# Altium schematic sheet ChassisPowerDistribution_B_1.0_RW.SchDoc
size A2 portrait
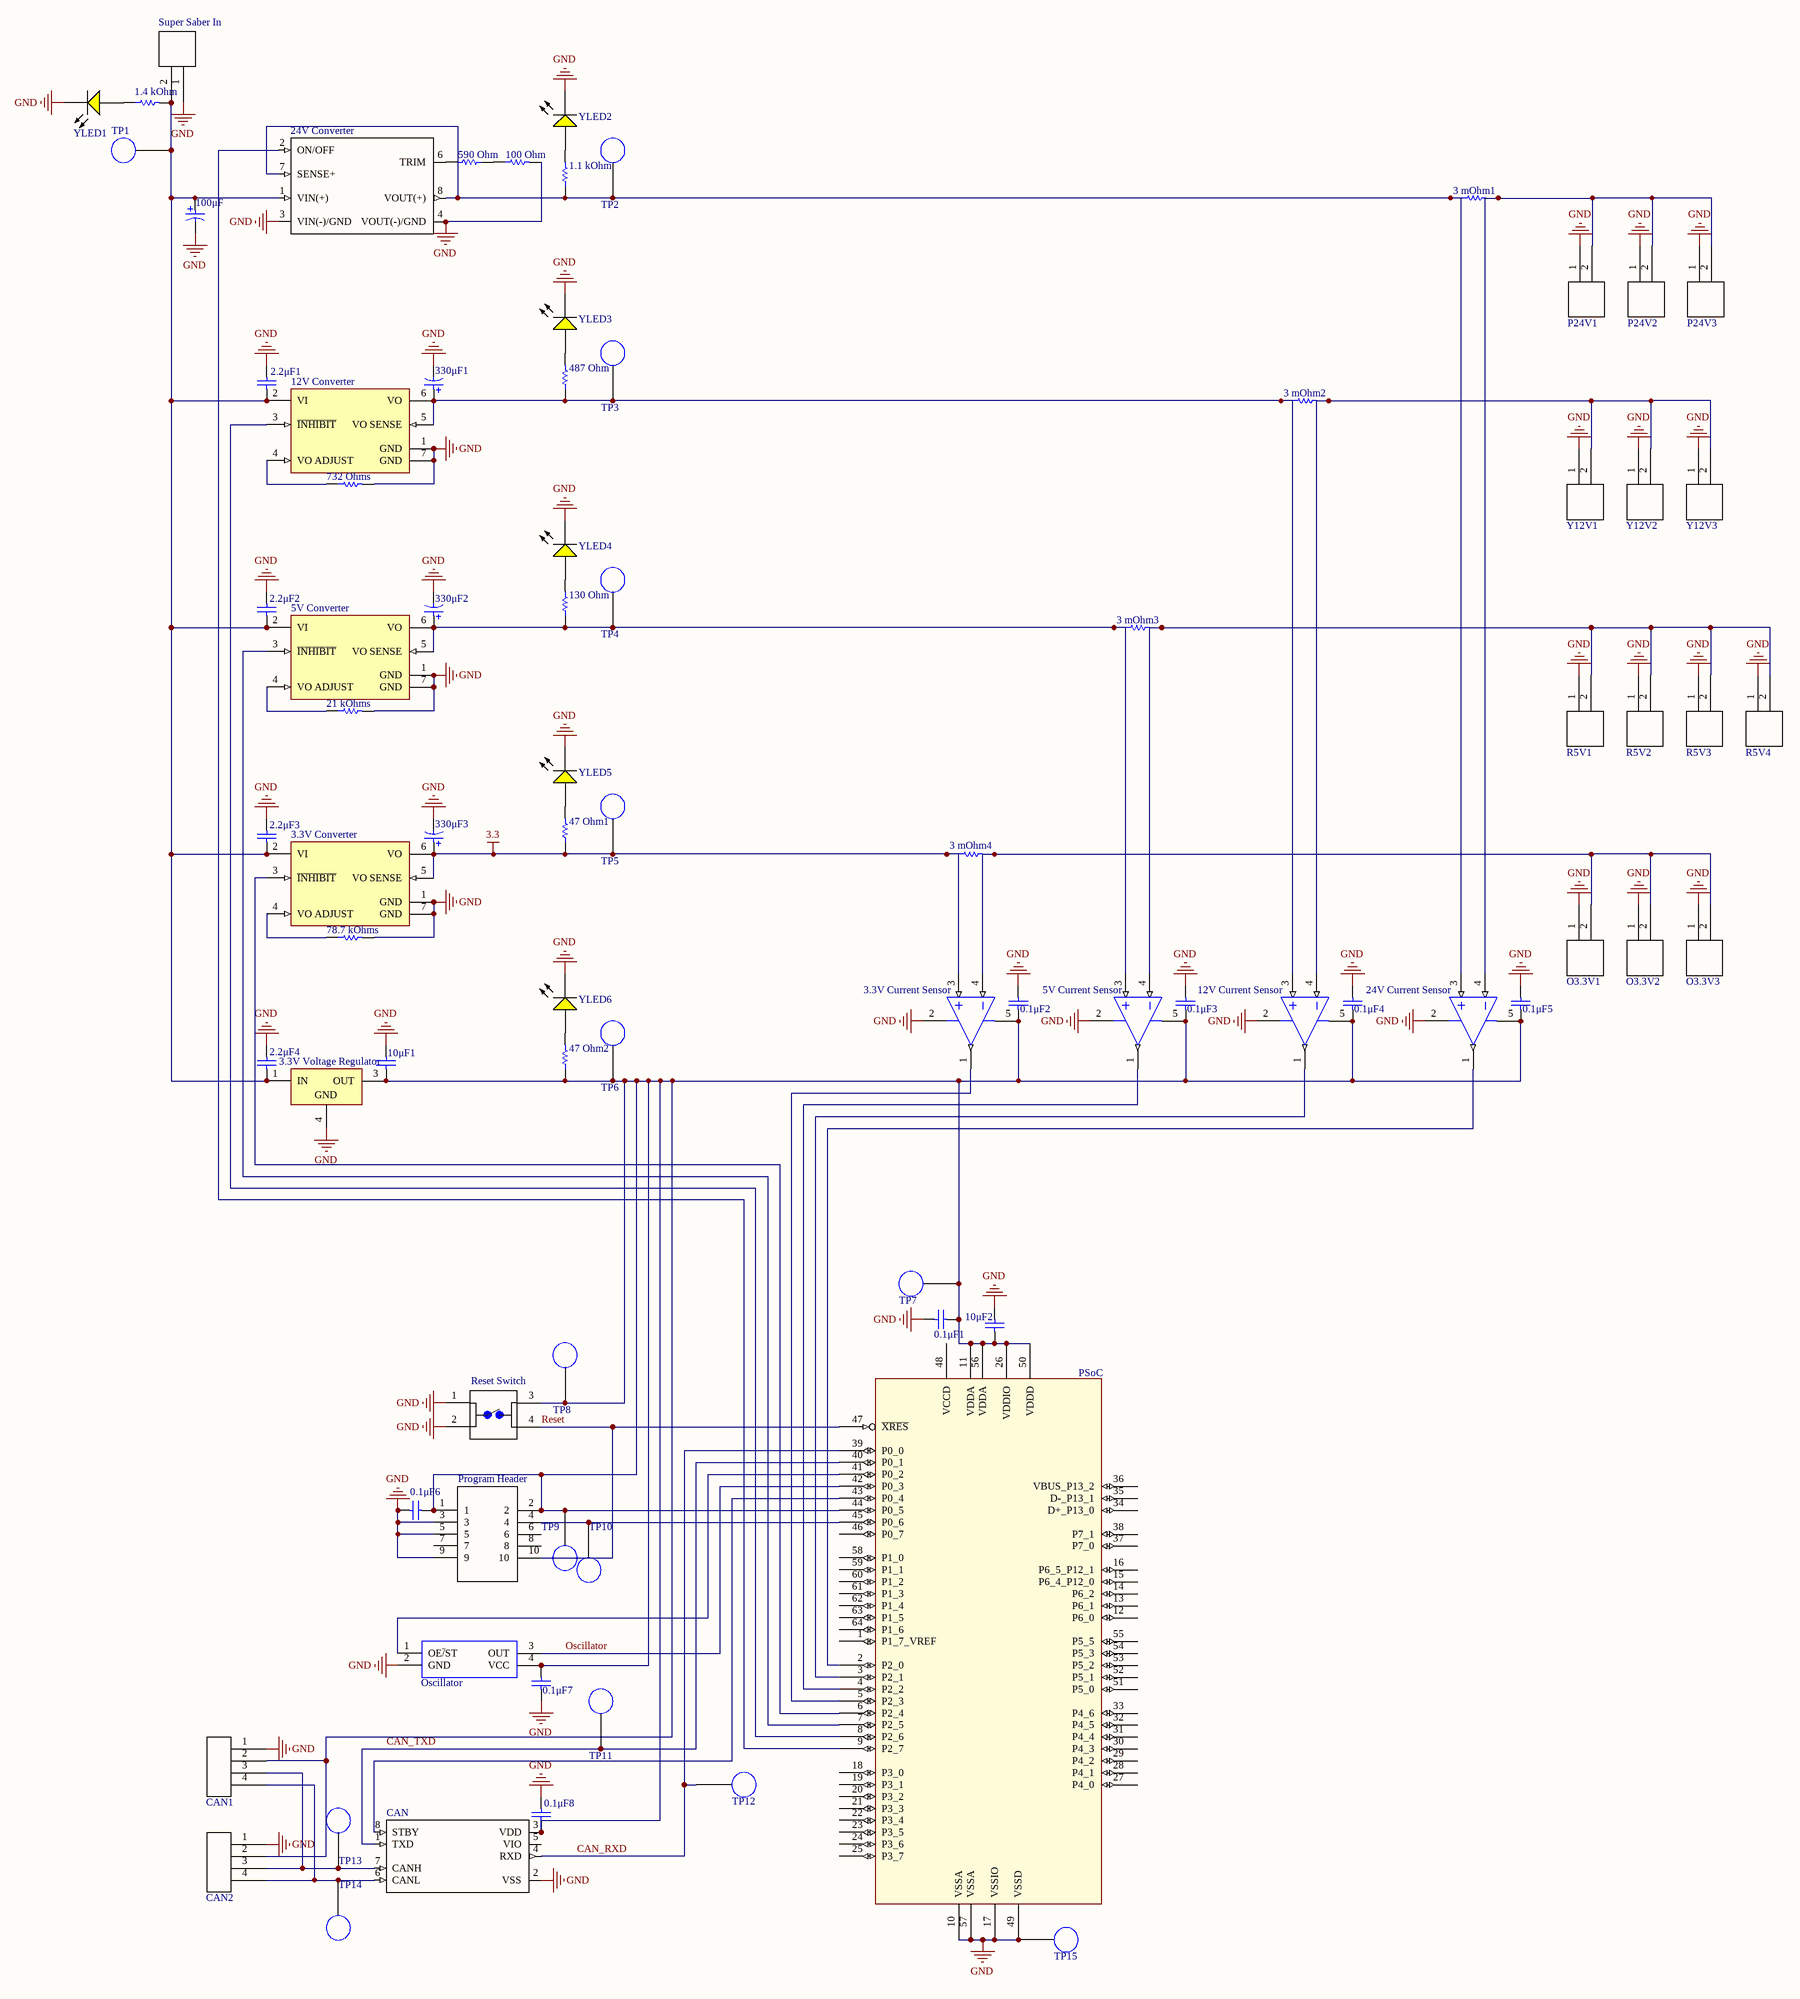
[diagram p0: ChassisPowerDistribution_B_1.0_RW.SchDoc]

## Parts
0.1μF1  C0805C104Z5VACTU  [CAPC2013X145X50LL20T25]  (value not drawn)
0.1μF2  C0805C104Z5VACTU  [CAPC2013X145X50LL20T25]  (value not drawn)
0.1μF3  C0805C104Z5VACTU  [CAPC2013X145X50LL20T25]  (value not drawn)
0.1μF4  C0805C104Z5VACTU  [CAPC2013X145X50LL20T25]  (value not drawn)
0.1μF5  C0805C104Z5VACTU  [CAPC2013X145X50LL20T25]  (value not drawn)
0.1μF6  C0805C104Z5VACTU  [CAPC2013X145X50LL20T25]  (value not drawn)
0.1μF7  C0805C104Z5VACTU  [CAPC2013X145X50LL20T25]  (value not drawn)
0.1μF8  C0805C104Z5VACTU  [CAPC2013X145X50LL20T25]  (value not drawn)
1.1_kOhm  ERJ-6GEYJ112V  [RESC2013X70X40ML20T20]  (value not drawn)
1.4_kOhm  RC0805FR-071K4L  [RESC2013X60X35ML10T20]  (value not drawn)
2.2μF1  C2012X7R1H225K125AC  [CAPC2013X145X20LL20]  (value not drawn)
2.2μF2  C2012X7R1H225K125AC  [CAPC2013X145X20LL20]  (value not drawn)
2.2μF3  C2012X7R1H225K125AC  [CAPC2013X145X20LL20]  (value not drawn)
2.2μF4  C2012X7R1H225K125AC  [CAPC2013X145X20LL20]  (value not drawn)
3.3V_Converter  PTN78020WAH  [EUK0007A]  (value not drawn)
3.3V_Current_Sensor  INA194AIDBVR  [DBV0005A_M]  (value not drawn)
3.3V_Voltage_Regulator  LP2950CDTX-3.3  [TD03B_M]  (value not drawn)
3_mOhm1  OAR5R003JLF  [OAR5R003JLF]  (value not drawn)
3_mOhm2  OAR5R003JLF  [OAR5R003JLF]  (value not drawn)
3_mOhm3  OAR5R003JLF  [OAR5R003JLF]  (value not drawn)
3_mOhm4  OAR5R003JLF  [OAR5R003JLF]  (value not drawn)
5V_Converter  PTN78020WAH  [EUK0007A]  (value not drawn)
5V_Current_Sensor  INA194AIDBVR  [DBV0005A_M]  (value not drawn)
10μF1  TPSR106K006R1000  [CAPC2113X140X50ML20T30]  (value not drawn)
10μF2  TPSR106K006R1000  [CAPC2113X140X50ML20T30]  (value not drawn)
12V_Converter  PTN78020WAH  [EUK0007A]  (value not drawn)
12V_Current_Sensor  INA194AIDBVR  [DBV0005A_M]  (value not drawn)
21_kOhms  ERJ-6ENF2102V  [RESC2013X70X40ML20T20]  (value not drawn)
24V_Converter  I6A4W010A033V-001-R  [*TDK-LAMBDA_I6A4W020A033V-001-R]  (value not drawn)
24V_Current_Sensor  INA194AIDBVR  [DBV0005A_M]  (value not drawn)
47_Ohm1  RR1220Q-470-D  [RESC2013X50X40LL20T20]  (value not drawn)
47_Ohm2  RR1220Q-470-D  [RESC2013X50X40LL20T20]  (value not drawn)
78.7_kOhms  ERJ-6ENF7872V  [RESC2013X70X40LL20T20]  (value not drawn)
100_Ohm  ERJ-6ENF1000V  [RESC2013X70X40LL20T20]  (value not drawn)
100μF  EEU-FC1V101  [*CAPPRD350W60D800H2000]  (value not drawn)
130_Ohm  RC0805JR-07130RL  [RESC2013X60X35ML10T20]  (value not drawn)
330μF1  EEU-FC1V331B  [*CAPPRD350W60D800H2000]  (value not drawn)
330μF2  EEU-FC1V331B  [*CAPPRD350W60D800H2000]  (value not drawn)
330μF3  EEU-FC1V331B  [*CAPPRD350W60D800H2000]  (value not drawn)
487_Ohm  RC0805FR-07487RL  [RESC2013X60X35NL10T20]  (value not drawn)
590_Ohm  ERJ-6ENF5900V  [RESC2013X70X40LL20T20]  (value not drawn)
732_Ohms  ERJ-6ENF7320V  [RESC2013X70X40LL20T20]  (value not drawn)
CAN  MCP2562-E/SN  [SOIC127P600X175-8N]  (value not drawn)
CAN1  Molex Micro  [0430450427]  (value not drawn)
CAN2  Molex Micro  [0430450427]  (value not drawn)
O3.3V1  *  [1510482204]  (value not drawn)
O3.3V2  *  [1510482204]  (value not drawn)
O3.3V3  *  [1510482204]  (value not drawn)
Oscillator  SG-636PCW_50.0000MC3__ROHS  [SG-636]  (value not drawn)
P24V1  *  [1510482204]  (value not drawn)
P24V2  *  [1510482204]  (value not drawn)
P24V3  *  [1510482204]  (value not drawn)
Program_Header  *  [SAMTEC-FTSH-105-01-X-D]  (value not drawn)
PSoC  CY8C4248AZI-L485  [TQFP50P1200X1200X160-64N]  (value not drawn)
R5V1  *  [1510482204]  (value not drawn)
R5V2  *  [1510482204]  (value not drawn)
R5V3  *  [1510482204]  (value not drawn)
R5V4  *  [1510482204]  (value not drawn)
Reset_Switch  1825910-7  [Switch 6mm 24V (NO)]  (value not drawn)
Super_Saber_In  *  (value not drawn)
TP1  *  [Test Point Through-hole]  (value not drawn)
TP2  *  [Test Point Through-hole]  (value not drawn)
TP3  *  [Test Point Through-hole]  (value not drawn)
TP4  *  [Test Point Through-hole]  (value not drawn)
TP5  *  [Test Point Through-hole]  (value not drawn)
TP6  *  [Test Point Through-hole]  (value not drawn)
TP7  *  [Test Point Through-hole]  (value not drawn)
TP8  *  [Test Point Through-hole]  (value not drawn)
TP9  *  [Test Point Through-hole]  (value not drawn)
TP10  *  [Test Point Through-hole]  (value not drawn)
TP11  *  [Test Point Through-hole]  (value not drawn)
TP12  *  [Test Point Through-hole]  (value not drawn)
TP13  *  [Test Point Through-hole]  (value not drawn)
TP14  *  [Test Point Through-hole]  (value not drawn)
TP15  *  [Test Point Through-hole]  (value not drawn)
Y12V1  *  [1510482204]  (value not drawn)
Y12V2  *  [1510482204]  (value not drawn)
Y12V3  *  [1510482204]  (value not drawn)
YLED1  LTST-C170KSKT  [LTST-C170KSKT_V]  (value not drawn)
YLED2  LTST-C170KSKT  [LTST-C170KSKT_V]  (value not drawn)
YLED3  LTST-C170KSKT  [LTST-C170KSKT_V]  (value not drawn)
YLED4  LTST-C170KSKT  [LTST-C170KSKT_V]  (value not drawn)
YLED5  LTST-C170KSKT  [LTST-C170KSKT_V]  (value not drawn)
YLED6  LTST-C170KSKT  [LTST-C170KSKT_V]  (value not drawn)

## Nets
3.3: 3.3V_Converter.5(VO_SENSE) 3.3V_Converter.6(VO) 3.3V_Current_Sensor.3(VIN+) 3_mOhm4.1 47_Ohm1.1 330μF3.1 TP5.1
GND: 0.1μF1.1 0.1μF2.2 0.1μF3.2 0.1μF4.2 0.1μF5.2 0.1μF6.1 0.1μF7.2 0.1μF8.2 2.2μF1.2 2.2μF2.2 2.2μF3.2 2.2μF4.2 3.3V_Converter.1(GND) 3.3V_Converter.7(GND) 3.3V_Current_Sensor.2(GND) 3.3V_Voltage_Regulator.4(GND) 5V_Converter.1(GND) 5V_Converter.7(GND) 5V_Current_Sensor.2(GND) 10μF1.2 10μF2.2 12V_Converter.1(GND) 12V_Converter.7(GND) 12V_Current_Sensor.2(GND) 21_kOhms.2 24V_Converter.3(VIN(-)/GND) 24V_Converter.4(VOUT(-)/GND) 24V_Current_Sensor.2(GND) 78.7_kOhms.2 100_Ohm.2 100μF.2 330μF1.2 330μF2.2 330μF3.2 732_Ohms.2 CAN.2(VSS) CAN1.1 CAN2.1 O3.3V1.1 O3.3V2.1 O3.3V3.1 Oscillator.2(GND) P24V1.1 P24V2.1 P24V3.1 Program_Header.3 Program_Header.5 Program_Header.9 PSoC.10(VSSA) PSoC.17(VSSIO) PSoC.49(VSSD) PSoC.57(VSSA) R5V1.1 R5V2.1 R5V3.1 R5V4.1 Reset_Switch.1 Reset_Switch.2 Super_Saber_In.1 TP15.1 Y12V1.1 Y12V2.1 Y12V3.1 YLED1.2(K) YLED2.2(K) YLED3.2(K) YLED4.2(K) YLED5.2(K) YLED6.2(K)
CAN_RXD: CAN.4(RXD) PSoC.39(P0_0) TP12.1
CAN_TXD: CAN.1(TXD) PSoC.40(P0_1) TP11.1
Oscillator: Oscillator.3(OUT) PSoC.42(P0_3)
Reset: Program_Header.10 PSoC.47(~{XRES}) Reset_Switch.4
Net0.1μF1_2: 0.1μF1.2 0.1μF2.1 0.1μF3.1 0.1μF4.1 0.1μF5.1 0.1μF6.2 0.1μF7.1 0.1μF8.1 3.3V_Current_Sensor.5(V+) 3.3V_Voltage_Regulator.3(OUT) 5V_Current_Sensor.5(V+) 10μF1.1 10μF2.1 12V_Current_Sensor.5(V+) 24V_Current_Sensor.5(V+) 47_Ohm2.1 CAN.3(VDD) CAN1.2 CAN2.2 Oscillator.4(VCC) Program_Header.1 Program_Header.2 PSoC.11(VDDA) PSoC.26(VDDIO) PSoC.44(P0_5) PSoC.50(VDDD) PSoC.56(VDDA) Reset_Switch.3 TP6.1 TP7.1 TP8.1 TP9.1
Net1.1_kOhm_1: 1.1_kOhm.1 3_mOhm1.1 24V_Converter.7(SENSE+) 24V_Converter.8(VOUT(+)) 24V_Current_Sensor.3(VIN+) TP2.1
Net1.1_kOhm_2: 1.1_kOhm.2 YLED2.1(A)
Net1.4_kOhm_1: 1.4_kOhm.1 YLED1.1(A)
Net1.4_kOhm_2: 1.4_kOhm.2 2.2μF1.1 2.2μF2.1 2.2μF3.1 2.2μF4.1 3.3V_Converter.2(VI) 3.3V_Voltage_Regulator.1(IN) 5V_Converter.2(VI) 12V_Converter.2(VI) 24V_Converter.1(VIN(+)) 100μF.1 Super_Saber_In.2 TP1.1
Net3.3V_Converter_3: 3.3V_Converter.3(~{INHIBIT}) PSoC.6(P2_4)
Net3.3V_Converter_4: 3.3V_Converter.4(VO_ADJUST) 78.7_kOhms.1
Net3.3V_Current_Sensor_1: 3.3V_Current_Sensor.1(OUT) PSoC.5(P2_3)
Net3.3V_Current_Sensor_4: 3.3V_Current_Sensor.4(VIN-) 3_mOhm4.2 O3.3V1.2 O3.3V2.2 O3.3V3.2
Net3_mOhm1_2: 3_mOhm1.2 24V_Current_Sensor.4(VIN-) P24V1.2 P24V2.2 P24V3.2
Net3_mOhm2_1: 3_mOhm2.1 12V_Converter.5(VO_SENSE) 12V_Converter.6(VO) 12V_Current_Sensor.3(VIN+) 330μF1.1 487_Ohm.1 TP3.1
Net3_mOhm2_2: 3_mOhm2.2 12V_Current_Sensor.4(VIN-) Y12V1.2 Y12V2.2 Y12V3.2
Net3_mOhm3_1: 3_mOhm3.1 5V_Converter.5(VO_SENSE) 5V_Converter.6(VO) 5V_Current_Sensor.3(VIN+) 130_Ohm.1 330μF2.1 TP4.1
Net3_mOhm3_2: 3_mOhm3.2 5V_Current_Sensor.4(VIN-) R5V1.2 R5V2.2 R5V3.2 R5V4.2
Net5V_Converter_3: 5V_Converter.3(~{INHIBIT}) PSoC.7(P2_5)
Net5V_Converter_4: 5V_Converter.4(VO_ADJUST) 21_kOhms.1
Net5V_Current_Sensor_1: 5V_Current_Sensor.1(OUT) PSoC.4(P2_2)
Net12V_Converter_3: 12V_Converter.3(~{INHIBIT}) PSoC.8(P2_6)
Net12V_Converter_4: 12V_Converter.4(VO_ADJUST) 732_Ohms.1
Net12V_Current_Sensor_1: 12V_Current_Sensor.1(OUT) PSoC.3(P2_1)
Net24V_Converter_2: 24V_Converter.2(ON/OFF) PSoC.9(P2_7)
Net24V_Converter_6: 24V_Converter.6(TRIM) 590_Ohm.2
Net24V_Current_Sensor_1: 24V_Current_Sensor.1(OUT) PSoC.2(P2_0)
Net47_Ohm1_2: 47_Ohm1.2 YLED5.1(A)
Net47_Ohm2_2: 47_Ohm2.2 YLED6.1(A)
Net100_Ohm_1: 100_Ohm.1 590_Ohm.1
Net130_Ohm_2: 130_Ohm.2 YLED4.1(A)
Net487_Ohm_2: 487_Ohm.2 YLED3.1(A)
NetCAN_6: CAN.6(CANL) CAN1.4 CAN2.4 TP14.1
NetCAN_7: CAN.7(CANH) CAN1.3 CAN2.3 TP13.1
NetCAN_8: CAN.8(STBY) PSoC.43(P0_4)
NetOscillator_1: Oscillator.1(OE~{/}ST) PSoC.41(P0_2)
NetProgram_Header_4: Program_Header.4 PSoC.45(P0_6) TP10.1

Not connected (* = marked no-connect by the designer): CAN 5(VIO); Program_Header 6 7 8; PSoC 1(P1_7_VREF) 12(P6_0) 13(P6_1) 14(P6_2) 15(P6_4_P12_0) 16(P6_5_P12_1) 18(P3_0) 19(P3_1) 20(P3_2) 21(P3_3) 22(P3_4) 23(P3_5) 24(P3_6) 25(P3_7) 27(P4_0) 28(P4_1) 29(P4_2) 30(P4_3) 31(P4_4) 32(P4_5) 33(P4_6) 34(D+_P13_0) 35(D-_P13_1) 36(VBUS_P13_2) 37(P7_0) 38(P7_1) 46(P0_7) 48(VCCD) 51(P5_0) 52(P5_1) 53(P5_2) 54(P5_3) 55(P5_5) 58(P1_0) 59(P1_1) 60(P1_2) 61(P1_3) 62(P1_4) 63(P1_5) 64(P1_6)

## Notes on the sheet
- Title
- Size:
- Date:
- File:
- A2
- Number:
- Time:
- Revision:
- Sheet
- of

## Library data of the parts
0.1μF1-0.1μF8 = CMP-2007-01258-1: Manufacturer: Kemet; Part Number: C0805C104Z5VACTU
1.1_kOhm = CMP-2001-00342-1: Manufacturer: Panasonic; Part Number: ERJ-6GEYJ112V
1.4_kOhm = CMP-2001-00962-1: Manufacturer: Yageo; Part Number: RC0805FR-071K4L
2.2μF1-2.2μF4 = CMP-2000-06040-1: Chip Capacitor, 2.2 uF, +/- 10%, 50 V, -55 to 125 degC, 0805 (2012 Metric), RoHS, Tape and Reel; Manufacturer: TDK; PCN Part Number: MLCCPartNumberChange30/Nov/2012; Other Names: 445-5968-1; Temperature Coefficient: X7R; Catalog Drawings: CSERIES_2012-0805_1.45; Kits: 445-9015-KIT-ND-KITMLCC1000PF-47UF080510-50V445-9003-KIT-ND-KITCAPCERHICAPMLCCSMD445-173086-KIT-ND-C0402-2220X7R6.3-50V1,000PF-; Online Catalog: CSeries,GeneralPurpose; Voltage - Rated: 50V; Capacitance: 2.2µF; Product Training Modules: CSeriesGeneralApplicationsSEAT,CCV,andTVCLDesignToolsGuidetoReplacinganElectrolyticCapacitorwithanMLCC; Operating Temperature: -55°C~125°C; Features: -; Tolerance: ±10%; Datasheet URL: https://datasheet.ciiva.com/24216/c2012x7r1h225k125ac-265016-24216364.pdf; Lead Style: -; Mounting Technology: SurfaceMount; Package Reference: 0805; RoHS Information: RoHSCertificate-MLCC; Height - Seated (Max): -; Manufacturer URL: http://www.tdk.com/; Standard Package: 1; Category: Capacitors; Package Description: 2-Pin Surface Mount Device, Body 2 x 1.25 mm; Packaging: CutTape(CT); Series: C; Applications: GeneralPurpose; Package / Case: 0805(2012Metric); Ratings: -; Datasheet Version: 09/2013; Family: CeramicCapacitors; Mounting Type: SurfaceMount,MLCC; Lead Spacing: -
3.3V_Converter 5V_Converter 12V_Converter = CMP-0387-00547-2: 6 A Wide-Input Voltage Adjustable Switching Regulator, -40 to 85 degC, 7-pin Module (EUK7), Pb-Free (RoHS); Manufacturer: Texas Instruments; Vout(Min)(V): 2.5; Vin(Max)(V): 36; Vout(Max)(V): 12.6; Vin(Min)(V): 7; VO Adjustable: TRUE; SubFamily: Non-Isolated POL; Regulated Outputs(#): 1; Iout(Max)(A): 6; ComponentLink3Description: Package Specification; ComponentLink3URL: http://www.ti.com/litv/pdf/mpds185; PackageDescription: 7-Pin Plastic Special Shape, Body 22.1 x 37.97 mm; ComponentLink4URL: Samples URL:http://www.ti.com/product/ptn78020w#samples; DatasheetVersion: SLTS228C; ComponentLink2Description: Datasheet; ComponentLink4Description: URL Link1; ComponentLink1Description: Manufacturer URL; Mounting Technology: Through Hole; Eco-Plan: Pb-Free (RoHS); PartNumber: PTN78020WAH; PackageVersion: 4204986-2/C; ComponentLink2URL: http://www.ti.com/general/docs/lit/getliterature.tsp?genericPartNumber=PTN78020W&fileType=pdf; PackageReference: EUK0007A; ComponentLink1URL: http://www.ti.com/
3.3V_Current_Sensor 5V_Current_Sensor 12V_Current_Sensor 24V_Current_Sensor = CMP-0704-00036-2: Voltage Output High-Side Measurement Current Shunt Monitor, 2.7 to 18 V, -40 to 125 degC, 5-pin SOT23 (DBV5), Green (RoHS & no Sb/Br); Manufacturer: Texas Instruments; Quiescent Current (+/-)(Typ)(mA): 0.7; Input Offset (+/-)(Max)(uV): 2000; Gain(V/V): 50; Vs(Min)(V): 2.7; Rating: Catalog; Small-Signal Bandwidth(Typ)(MHz): 0.3; CMRR(Min)(dB): 80; Common Mode Range(Min)(V): -16; Vs(Max)(V): 18; ComponentLink2Description: Datasheet; Eco-Plan: Green (RoHS & no Sb/Br); ComponentLink1URL: http://www.ti.com/; Code_JEDEC: MO-178; SubFamily: Current Shunt Monitor; ComponentLink3URL: http://www.ti.com/lit/ml/mpds018j/mpds018j.pdf; PackageVersion: 4073253-4/K, 03/2006; PartNumber: INA194AIDBVR; DatasheetVersion: SBOS307F; ComponentLink1Description: Manufacturer URL; ComponentLink3Description: Package Specification; Output Type: Voltage; Mounting Technology: Surface Mount; ComponentLink2URL: http://www.ti.com/general/docs/lit/getliterature.tsp?genericPartNumber=INA194&fileType=pdf; Common Mode Range(Max)(V): 80; PackageDescription: 5-Pin Plastic Small Outline, Body 1.6 x 2.9 mm, Pitch 0.95 mm; PackageReference: DBV0005A
3.3V_Voltage_Regulator = CMP-0062-00251-2: Series of Adjustable Micropower Voltage Regulators, 3-pin TO-252; Manufacturer: National Semiconductor; CompType: LDO IC; PowerWise: N; PackageTopMarking: NSUZXYTT*LP2950*CDT-3.3; PackageReference: TD03B; PackageDescription: TO252, Molded, Jedec, 6.8 x 6.10 x 2.30mm Body, 3 Lead, 2.28mm Pitch, Surface Mount; PackageVersion: revD, Feb-2009; DatasheetVersion: May-2005; Code_JEDEC: TO-252-AA; RoHS: N; PinCount: 3; RevisionNote: Component URLs added; ComponentLink1Description: LP2950 Datasheet; ComponentLink2URL: http://www.national.com/pf/LP/LP2950.html; ComponentLink3URL: http://www.national.com/packaging/folders/td03b.html; ComponentLink1URL: http://www.national.com/ds/LP/LP2950.pdf; ComponentLink2Description: LP2950 Web Page; ComponentLink3Description: TD03B Package Page
3_mOhm1-3_mOhm4 = Res1: Resistor; Manufacturer_Name: TT Electronics; Manufacturer_Part_Number: OAR5R003JLF; Data Sheet Link: www.ttelectronics.com/TTElectronics/media/ProductFiles/Resistors/Datasheets/OAR.pdf
10μF1 10μF2 = CMP-2007-04023-1: Manufacturer: AVX Interconnect / Elco; Part Number: TPSR106K006R1000
21_kOhms = CMP-2001-00037-1: Manufacturer: Panasonic; Part Number: ERJ-6ENF2102V
24V_Converter = I6A4W020A033V-001-R: Dc-Dc, Pcb Mount, Sixteenth Brick, Input 24vdc, Output 3.3-40v 20a, 250w, Neg Logic; MF: TDK-Lambda Americas; SnapEDA_Link: https://www.snapeda.com/parts/I6A4W020A033V-001-R/TDK-Lambda%20Americas%20Inc./view-part/?ref=snap; Digi-Key_Part_Number: 285-2670-ND; MP: I6A4W010A033V-001-R; Package: DIP-7 TDK-Lambda; Digi-Key_Purchase_URL: https://www.digikey.com/product-detail/en/tdk-lambda-americas-inc/I6A4W010A033V-001-R/285-2670-ND/6605123; Value: *
47_Ohm1 47_Ohm2 = CMP-2001-03559-1: Manufacturer: Susumu; Part Number: RR1220Q-470-D
78.7_kOhms = CMP-2001-00298-1: Manufacturer: Panasonic; Part Number: ERJ-6ENF7872V
100_Ohm = CMP-1665-00009-4: Chip Resistor, 100 Ohm, +/- 1%, 0.125 W, -55 to 155 degC, 0805 (2012 Metric), RoHS, Tape and Reel; Manufacturer: Panasonic; Voltage Rating: 150 V; Height: 0.6 mm; RoHSCompliant: true; Min Operating Temperature: -55 degC; REACH SVHC: Yes; Package Quantity: 5000; ComponentLink2Description: Datasheet; ComponentLink1URL: http://www.panasonic.com/; Mount: Surface Mount; Max Operating Temperature: 155 degC; ComponentLink1Description: Manufacturer URL; Mounting Technology: Surface Mount; PackageReference: 0805; DatasheetVersion: 04/2015; Pins: 2; Length: 2 mm; Packaging: Tape and Reel; ComponentLink2URL: http://industrial.panasonic.com/cdbs/www-data/pdf/RDA0000/AOA0000C86.pdf; PackageDescription: 2-Pin Surface Mount Device, Body 2 x 1.25 mm
100μF = PNSC-CAP-P-2: Aluminum Electrolytic Capacitor, 100 uF +/- 20%, 35 V, -55 to 105 degC, 2-Pin 8 x 8 x 11.5 mm Through-hole, RoHS, Tape and Reel; Manufacturer: Panasonic; Ripple Current: 555 mA; Rated Voltage: 35 V; Cap.: 100 uF; Capacitance Tolerance: +/- 20%; ComponentLink2URL: http://industrial.panasonic.com/www-cgi/jvcr13pz.cgi?E+PZ+3+ABA0022+EEUFC1V101+7+WW; Mounting Technology: Through Hole; ComponentLink3URL: http://industrial.panasonic.com/www-data/pdf/ABA0000/ABA0000PE245.pdf; ComponentLink2Description: Datasheet; PartNumber: EEU-FC1V101; PackageDescription: 2-Pin Through-hole, Base 8 x 8 mm, Height 11.5 mm; PackageReference: EEU-FC1V101; ComponentLink1URL: http://industrial.panasonic.com/; Temp. Range: -55 to 105 degC; RoHS: TRUE; Packing: Tape and Reel; ComponentLink1Description: Manufacturer URL; ComponentLink3Description: Package Specification
130_Ohm = CMP-2001-01345-1: Manufacturer: Yageo; Part Number: RC0805JR-07130RL
330μF1-330μF3 = PNSC-CAP-P-2: Aluminum Electrolytic Capacitor, 330 uF +/- 20%, 35 V, -55 to 105 degC, 2-Pin 10 x 10 x 17 mm Through-hole, RoHS, Cut Tape; Manufacturer: Panasonic; Ripple Current: 1.05 A; Rated Voltage: 35 V; Cap.: 330 uF; Capacitance Tolerance: +/- 20%; ComponentLink2URL: http://industrial.panasonic.com/www-cgi/jvcr13pz.cgi?E+PZ+3+ABA0022+EEUFC1V101+7+WW; Mounting Technology: Through Hole; ComponentLink3URL: http://industrial.panasonic.com/www-data/pdf/ABA0000/ABA0000PE245.pdf; ComponentLink2Description: Datasheet; PartNumber: EEU-FC1V331B; PackageDescription: 2-Pin Through-hole, Base 10 x 10 mm, Height 17 mm; PackageReference: EEU-FC1V331B; ComponentLink1URL: http://industrial.panasonic.com/; Temp. Range: -55 to 105 degC; RoHS: TRUE; Packing: Cut Tape; ComponentLink1Description: Manufacturer URL; ComponentLink3Description: Package Specification
487_Ohm = CMP-2001-01162-1: Manufacturer: Yageo; Part Number: RC0805FR-07487RL
590_Ohm = CMP-2001-00245-1: Manufacturer: Panasonic; Part Number: ERJ-6ENF5900V
732_Ohms = CMP-2001-00285-1: Manufacturer: Panasonic; Part Number: ERJ-6ENF7320V
CAN = MCP2562-E/SN: Microchip MCP2562-E/SN, CAN Transceiver 1MBps 1-channel IEC 61000-4-2, 8-Pin SOIC; Price: None; MF: Microchip; SnapEDA_Link: https://www.snapeda.com/parts/MCP2562-E/SN/Microchip/view-part/?ref=snap; MP: MCP2562-E/SN; Availability: Unavailable; Package: SO-8 Microchip; Value: *
CAN1 CAN2 = Molex micro-fit 4-pin (Single row schematic): Molex micro-fit 3.0 dual row header. P/N 0430450427
O3.3V1-O3.3V3 P24V1-P24V3 R5V1-R5V4 Y12V1-Y12V3 = Molex 6.5MM  power connector
Oscillator = SG-636: Standard Clock Oscillators 50MHz 3.3Volt 100ppm -20C +70C; Manufacturer_Name: Epson Timing; Manufacturer_Part_Number: SG-636PCW 50.0000MC3: ROHS; RS Part Number: *; RS Price/Stock: *; Arrow Part Number: SG-636PCW 50.0000MC3: ROHS; Arrow Price/Stock: *; Datasheet Link: http://www.mouser.com/ds/2/137/G-636PCE_en-1003252.pdf
Program_Header = SAMTEC-FTSH-105-01-X-D
Reset_Switch = Switch 6mm 24V (NO): FSM4JAH=6MM TACT SWITCH, HIGH TEMP; MF: TE Connectivity; Contact_Current_Rating: 50 mA; Configuration_Pole-Throw: Single Pole - Single Throw; Package: None; Digi-Key_Part_Number: 450-1804-ND; Digi-Key_Purchase_URL: https://www.digikey.com/product-detail/en/te-connectivity-alcoswitch-switches/1825910-7/450-1804-ND/1731414?utm_source=snapeda&utm_medium=aggregator&utm_campaign=symbol; MP: 1825910-7; SnapEDA_Link: https://www.snapeda.com/parts/1825910-7/TE%20Connectivity%20ALCOSWITCH%20Switches/view-part/?ref=snap; EU_RoHS_Compliance: Compliant; TE_purchase_URL: https://www.te.com/usa-en/product-1825910-7.html?te_bu=Cor&te_type=disp&te_campaign=seda_glo_cor-seda-global-disp-prtnr-fy19-seda-model-bom-cta_sma-317_1&elqCampaignId=32493; Value: *
Super_Saber_In = Super Saber
TP1-TP15 = Test Point
YLED1-YLED6 = CMP-2000-06621-1: LED Yellow, 75 mW, 80 mA, -55 to 85 degC, 2-Pin SMD, RoHS, Tape and Reel; Manufacturer: Lite-On; Main Category: ChipLED; Product Depth (mm): 1.25mm; Dominant Wave Length: 587nm; Viewing Angle: 130deg; Luminous Intensity: 112mcd; Test Current (It): 20mA; Emitting Color: Amber; Chip Material: AlGaInP; Product Height (mm): 1.1mm; Forward Voltage: 2.4V; High Brightness: Yes; Forward Current: 30mA; Number of  Elements: 1; Power Dissipation: 75W; Shape Type: Rectangular; Peak Wavelength: 588nm; Reverse Voltage: 5V; Rad Hardened: No; Product Length (mm): 2mm; DELETED: Compliant; Package Description: 2-Pin Surface Mount Device, Body 2 x 1.25 mm; Mounting: SurfaceMount; Lum Intensity: 112mcd; Pin Count: 2; Mounting Technology: SurfaceMount; Package Reference: C170KSKT; Datasheet Version: Rev. H, 04/2014; Package Type: ChipLed; Type: Uni-Color; Packaging: TapeandReel; Manufacturer URL: http://www.us.liteon.com/; Datasheet URL: http://optoelectronics.liteon.com/upload/download/DS-22-99-0188/S_110_LTST-C170KSKT.pdf; Operating Temp Range: -55Cto85C; Lens Dimensions: 1.4x1.25x0.6mm; Operating Temperature Classification: Industrial
PSoC = CY8C4248AZI-L485: Part_Number: CY8C4248AZI-L485